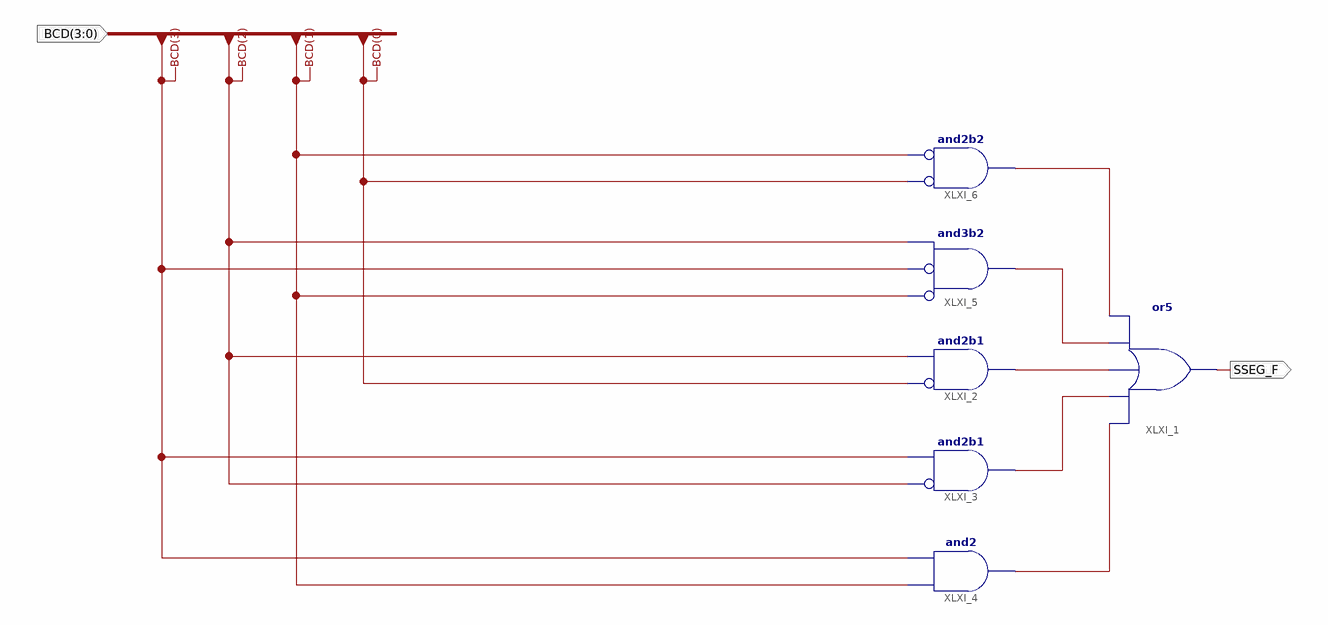
[diagram p0: schematic sheet 1]
// Xilinx ISE schematic SSEG_F.sch (spartan6) as structural Verilog: 6 symbols, 2 ports
module SSEG_F (
  input  [3:0] BCD,
  output SSEG_F
);

  wire XLXN_12, XLXN_13, XLXN_14, XLXN_15, XLXN_16;

  or XLXI_1 (SSEG_F, XLXN_13, XLXN_14, XLXN_16, XLXN_15, XLXN_12);
  and XLXI_2 (XLXN_16, ~BCD[0], BCD[2]);  // and2b1
  and XLXI_3 (XLXN_14, ~BCD[2], BCD[3]);  // and2b1
  and XLXI_4 (XLXN_13, BCD[1], BCD[3]);
  and XLXI_5 (XLXN_15, ~BCD[1], ~BCD[3], BCD[2]);  // and3b2
  and XLXI_6 (XLXN_12, ~BCD[0], ~BCD[1]);  // and2b2
endmodule
